# Altium schematic sheet 3-Power-Supply.SchDoc: Thermocouple Temperature Logger
size A4; Date: 14.03.2026; Author: MG & JK; Revision: 1-0; SheetNumber: 3; SheetTotal: 7; Model: Rev 1.0; PageSetup: Record=PageOptions|CenterHorizontal=True|CenterVertical=True|PrintScale=0.52|XCorrection=1.00|YCorrection=1.00|PrintKind=1|BorderSize=5000000|LeftOffset=0|BottomOffset=0|Orientation=2|PaperLength=4200|PaperWidth=2970|Scale=100|PaperSource=7|PrintQuality=600|MediaType=1|DitherType=10|PaperKind=A3|PrintScaleMode=1; SPICEModelCacheCZHDBFPD: <root> / <DocumentId>CZHDBFPD</DocumentId> / <CacheFrame Number="0"> / <Model Name="860020274017_1.5mf" Kind="CKT"> / <Text>******* / .subckt 860020274017_1.5mF 1 2 / Rser 1 3 0.093 / Lser 2 4 0.0000000299 / C1 3 4 0.0015 / Rpar 3 4 66666.6666666667 / .ends 860020274017_1.5mF</Text> / </Model> / <Model Name="4828_74408942033_3.3u" Kind="CKT"> / <Text>******* / .subckt 4828_74408942033_3.3u 1 2 / Rp 1 2 3423 / Cp 1 2 4.02904p / Rs 1 N3 0.0483 / L1 N3 2 3.3u / .ends 4828_74408942033_3.3u</Text> / </Model> / </CacheFrame> / </root>
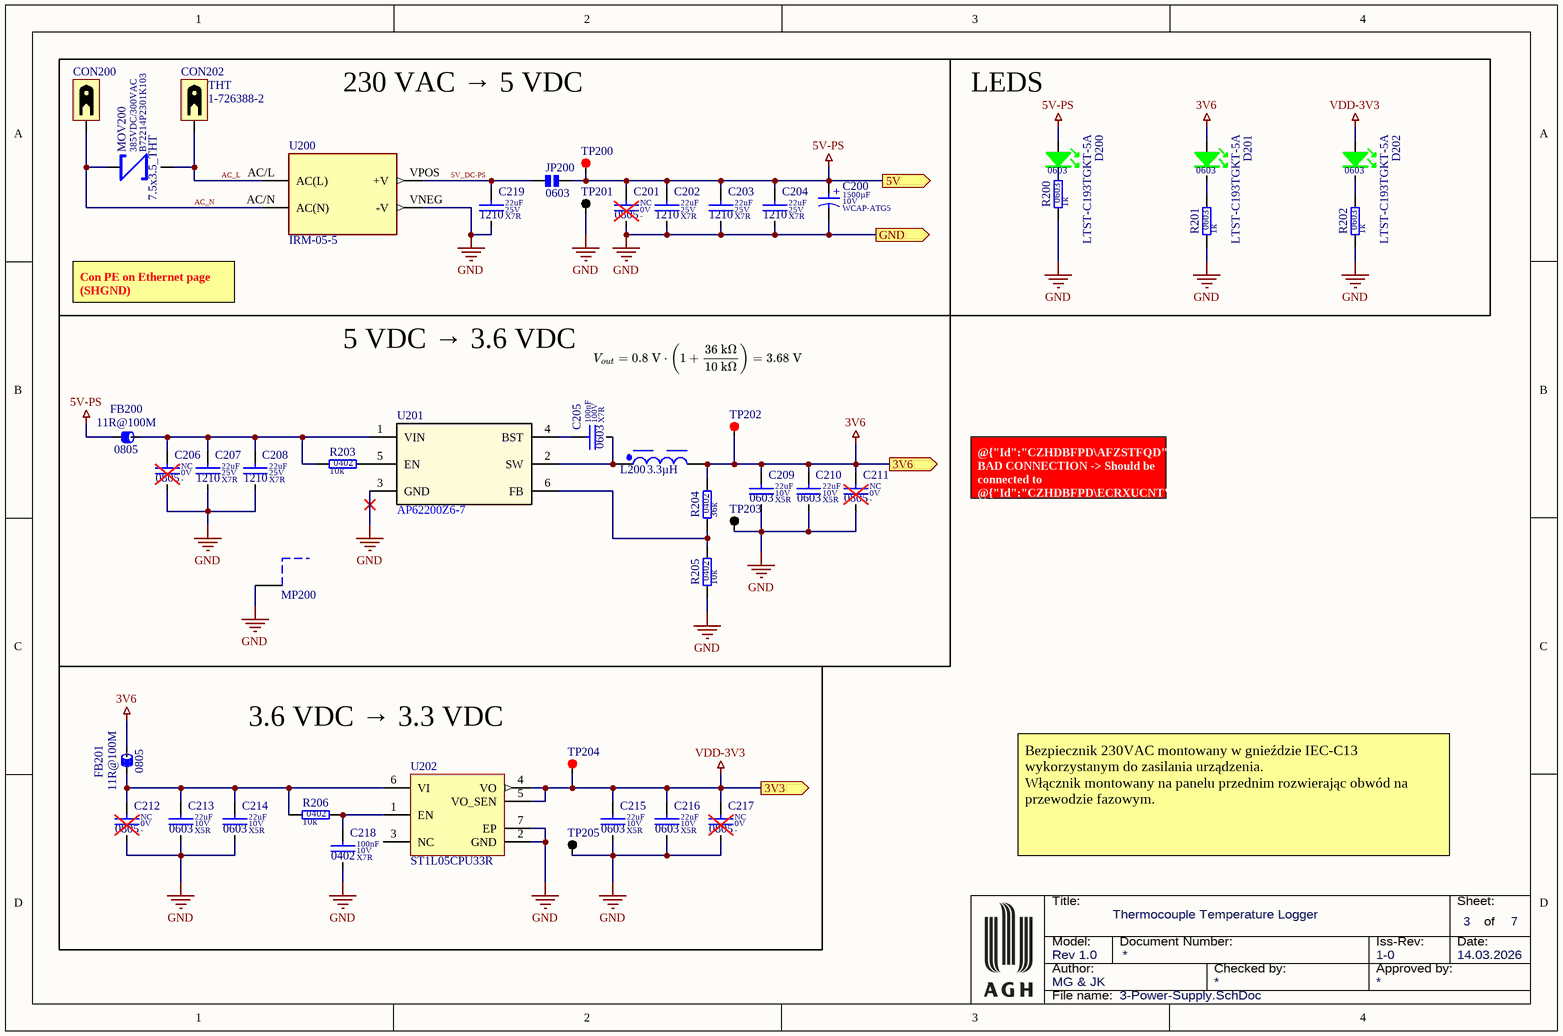
[diagram p0: 3-Power-Supply.SchDoc]

## Parts
C200  1500µF  Match Code: WCAP-ATG5  Rated Voltage (DC): 10V  [WCAP-ATG5_D8H20]
C201  value NC  Voltage: 0V  SCH_Footprint: 0805  [C_NC_0805_2012]  (hidden comment: -)  (no BOM)
C202  value 22uF  Dielectric: X7R  Voltage: 25V  SCH_Footprint: 1210  [C_1210_3225]  (hidden comment: Ceramic X7R Low ESR)
C203  value 22uF  Dielectric: X7R  Voltage: 25V  SCH_Footprint: 1210  [C_1210_3225]  (hidden comment: Ceramic X7R Low ESR)
C204  value 22uF  Dielectric: X7R  Voltage: 25V  SCH_Footprint: 1210  [C_1210_3225]  (hidden comment: Ceramic X7R Low ESR)
C205  value 100nF  Dielectric: X7R  Voltage: 100V  SCH_Footprint: 0603  [C_0603_1608]  (hidden comment: Ceramic X7R)
C206  value NC  Voltage: 0V  SCH_Footprint: 0805  [C_NC_0805_2012]  (hidden comment: -)  (no BOM)
C207  value 22uF  Dielectric: X7R  Voltage: 25V  SCH_Footprint: 1210  [C_1210_3225]  (hidden comment: Ceramic X7R Low ESR)
C208  value 22uF  Dielectric: X7R  Voltage: 25V  SCH_Footprint: 1210  [C_1210_3225]  (hidden comment: Ceramic X7R Low ESR)
C209  value 22uF  Dielectric: X5R  Voltage: 10V  SCH_Footprint: 0603  [C_0603_1608]  (hidden comment: Ceramic X5R)
C210  value 22uF  Dielectric: X5R  Voltage: 10V  SCH_Footprint: 0603  [C_0603_1608]  (hidden comment: Ceramic X5R)
C211  value NC  Voltage: 0V  SCH_Footprint: 0805  [C_NC_0805_2012]  (hidden comment: -)  (no BOM)
C212  value NC  Voltage: 0V  SCH_Footprint: 0805  [C_NC_0805_2012]  (hidden comment: -)  (no BOM)
C213  value 22uF  Dielectric: X5R  Voltage: 10V  SCH_Footprint: 0603  [C_0603_1608]  (hidden comment: Ceramic X5R)
C214  value 22uF  Dielectric: X5R  Voltage: 10V  SCH_Footprint: 0603  [C_0603_1608]  (hidden comment: Ceramic X5R)
C215  value 22uF  Dielectric: X5R  Voltage: 10V  SCH_Footprint: 0603  [C_0603_1608]  (hidden comment: Ceramic X5R)
C216  value 22uF  Dielectric: X5R  Voltage: 10V  SCH_Footprint: 0603  [C_0603_1608]  (hidden comment: Ceramic X5R)
C217  value NC  Voltage: 0V  SCH_Footprint: 0805  [C_NC_0805_2012]  (hidden comment: -)  (no BOM)
C218  value 100nF  Dielectric: X7R  Voltage: 10V  SCH_Footprint: 0402  [C_0402_1005]  (hidden comment: Ceramic X7R)
C219  value 22uF  Dielectric: X7R  Voltage: 25V  SCH_Footprint: 1210  [C_1210_3225]  (hidden comment: Ceramic X7R Low ESR)
CON200  Terminal for PE  [TP_1-726388-2]  (value not drawn)
CON202  value 1-726388-2  SCH_Footprint: THT  [TP_1-726388-2]  (hidden comment: Terminal for PE)
D200  value LTST-C193TGKT-5A  SCH_Footprint: 0603  [OL_0603_1608]  (hidden comment: Green Led 0603)
D201  value LTST-C193TGKT-5A  SCH_Footprint: 0603  [OL_0603_1608]  (hidden comment: Green Led 0603)
D202  value LTST-C193TGKT-5A  SCH_Footprint: 0603  [OL_0603_1608]  (hidden comment: Green Led 0603)
FB200  value 11R@100M  SCH_Footprint: 0805  [FB_0805_2012]  (hidden comment: Ferrite bead)
FB201  value 11R@100M  SCH_Footprint: 0805  [FB_0805_2012]  (hidden comment: Ferrite bead)
JP200  SCH_Footprint: 0603  [JP_0603_1608]  (hidden comment: Solder Jumper 0603/1608)
L200  Inductance: 3.3µH  [WE-SPC_4828]  (hidden comment: 3.3µH, 2.1A)
MOV200  value B72214P2301K103  SCH_Footprint: 7.5x3.5_THT  Voltage: 385VDC/300VAC  [MOV_AXIAL_7.5_3.5]  (hidden comment: MOV)
MP200  36702638  [36702638]  (value not drawn)
R200  value 1k  SCH_Footprint: 0603  [R_0603_1608]  (hidden comment: Resistor)
R201  value 1k  SCH_Footprint: 0603  [R_0603_1608]  (hidden comment: Resistor)
R202  value 1k  SCH_Footprint: 0603  [R_0603_1608]  (hidden comment: Resistor)
R203  value 10k  SCH_Footprint: 0402  [R_0402_1005]  (hidden comment: Resistor)
R204  value 36k  SCH_Footprint: 0402  [R_0402_1005]  (hidden comment: Resistor)
R205  value 10k  SCH_Footprint: 0402  [R_0402_1005]  (hidden comment: Resistor)
R206  value 10k  SCH_Footprint: 0402  [R_0402_1005]  (hidden comment: Resistor)
TP200  Test loop THT  [TP_KEYSTONE_5000_RED]  (value not drawn)
TP201  Test loop THT  [TP_KEYSTONE_5001_BLACK]  (value not drawn)
TP202  Test loop THT  [TP_KEYSTONE_5000_RED]  (value not drawn)
TP203  Test loop THT  [TP_KEYSTONE_5001_BLACK]  (value not drawn)
TP204  Test loop THT  [TP_KEYSTONE_5000_RED]  (value not drawn)
TP205  Test loop THT  [TP_KEYSTONE_5001_BLACK]  (value not drawn)
U200  IRM-05-5  [CONV_IRM-05-5]
U201  AP62200Z6-7  [SOT563-Z6_1_DIO]
U202  ST1L05CPU33R  [DFN6D_N]

## Blocks framed on the sheet
LEDS: D200-D202 R200-R202
5 VDC → 3.6 VDC: C205-C211 FB200 L200 MP200 R203-R205 TP202 TP203 U201
3.6 VDC → 3.3 VDC: C212-C218 FB201 R206 TP204 TP205 U202

## Ports
3V3 (out, see 1-Block-diagram[1A], 2-STM32H563[2A], 4-Ethernet[1A], 5-SD-Card[1A], 6-Connectors[1A]), 3V6 (out, see 1-Block-diagram[1A], 6-Connectors[1A], 7-LTC2983[1A]), 5V (out, see 1-Block-diagram[1A], 6-Connectors[1A]), GND (out, see 1-Block-diagram[1A], 2-STM32H563[2A], 4-Ethernet[1A], 5-SD-Card[1A], 6-Connectors[1A], 7-LTC2983[1A])

## Nets
3V6: C209.1 C210.1 C211.1 D201.2(A) FB201.2 L200.2 R204.2 TP202.1(TP) ; port 3V6
5V-PS: C200.1(P) C201.1 C202.1 C203.1 C204.1 D200.2(A) FB200.1 JP200.2 TP200.1(TP) ; port 5V
GND: C200.2(N) C201.2 C202.2 C203.2 C204.2 C206.2 C207.2 C208.2 C209.2 C210.2 C211.2 C212.2 C213.2 C214.2 C215.2 C216.2 C217.2 C218.2 C219.2 MP200.1 R200.1 R201.1 R202.1 R205.1 TP201.1(TP) TP203.1(TP) TP205.1(TP) U200.VNEG(-V) U201.3(GND) U202.2(GND) U202.7(EP) ; port GND
VDD-3V3: C215.1 C216.1 C217.1 D202.2(A) TP204.1(TP) U202.4(VO) U202.5(VO_SEN) ; port 3V3
5V_DC-PS: C219.1 JP200.1 U200.VPOS(+V)
AC_L: CON202.1(TP) MOV200.1 U200.AC/L(AC(L))
AC_N: CON200.1(TP) MOV200.2 U200.AC/N(AC(N))
NetC205_1: C205.1 U201.4(BST)
NetC205_2: C205.2 L200.1 U201.2(SW)
NetC206_1: C206.1 C207.1 C208.1 FB200.2 R203.1 U201.1(VIN)
NetC212_1: C212.1 C213.1 C214.1 FB201.1 R206.1 U202.6(VI)
NetC218_1: C218.1 R206.2 U202.1(EN)
NetD200_1: D200.1(K) R200.2
NetD201_1: D201.1(K) R201.2
NetD202_1: D202.1(K) R202.2
NetR203_2: R203.2 U201.5(EN)
NetR204_1: R204.1 R205.2 U201.6(FB)

Not connected (* = marked no-connect by the designer): U202 3(NC)

## Notes on the sheet
- 230 VAC → 5 VDC
- Con PE on Ethernet page (SHGND)
- @{"Id":"CZHDBFPD\AFZSTFQD","ObjectType":2} BAD CONNECTION -> Should be connected to @{"Id":"CZHDBFPD\ECRXUCNT","ObjectType":2} SW - BST not after inductor!
- Bezpiecznik 230VAC montowany w gnieździe IEC-C13 wykorzystanym do zasilania urządzenia.
  Włącznik montowany na panelu przednim rozwierając obwód na przewodzie fazowym.
- Title:
- Sheet:
- of
- Author:
- Model:
- Document Number:
- Checked by:
- Iss-Rev:
- Approved by:
- Date:
- File name:
- (in symbol 860020274017) +

## Library data of the parts
C200 = 860020274017: WCAP-ATG5 Aluminum Electrolytic Capacitor, Radial, THT, D8 x H20mm, 1500µF, 10V; Manufacturer: Wurth Elektronik; Capacitance Tolerance: +/-20%; Dissipation Factor: 17%; Endurance: 2000h; Leakage Current: 150µA; Ripple Current: 715mA; Technical Reference: ATDE200152M010DSPA7B000; Manufacturer Part Number: 860020274017; Category: Aluminum Electrolytic Capacitors; ComponentLink1Description: Website Link; ComponentLink1URL: https://www.we-online.com/redexpert/article/860020274017?ad; ComponentLink2Description: Datasheet Link; ComponentLink2URL: https://www.we-online.com/redexpert/spec/860020274017?ad; Mount: Through Hole; Operating Temperature Max: 105°C; Operating Temperature Min: -40°C; Packaging: Ammo Pack; Height: 20mm; Diameter: 8mm; Capacitance: 1500µF
C201 C206 C211 C212 C217 = C_GENERIC_0805: Capacitor; Tolerance (%): 0; Dielectric: -; Part Number: C_GENERIC_0805; HelpURL: -; Manufacturer: -; Manufacturer Part Number: -; Supplier 1: TME; Supplier 2: RS Components; Supplier 3: Farnell; Supplier 4: Mouser; Supplier 5: Digi-Key; Supplier 6: LCSC
C202-C204 C207 C208 C219 = C_22uF_25V_X7R_1210_20: Capacitor; Manufacturer: Murata; Manufacturer Part Number: GRM32ER71E226ME15L; Tolerance (%): 20; Part Number: C_22uF_25V_X7R_1210_20; HelpURL: https://www.murata.com/en-eu/api/pdfdownloadapi?cate=luCeramicCapacitorsSMD&partno=GRM32ER71E226ME15%23; Supplier 1: TME; Supplier 2: RS Components; Supplier Part Number 2: 8467372P; Supplier 3: Farnell; Supplier Part Number 3: 2218912; Supplier 4: Mouser; Supplier Part Number 4: 81-GRM32ER71E226ME5L; Supplier 5: Digi-Key; Supplier Part Number 5: 490-10758-1-ND; Supplier 6: LCSC; Supplier 7: Arrow Electronics; Supplier Part Number 7: GRM32ER71E226ME15L
C205 = C_100nF_100V_X7R_0603_10: Capacitor; Manufacturer: Kemet; Manufacturer Part Number: C0603X104K1RACTU; Tolerance (%): 10; Part Number: C_100nF_100V_X7R_0603_10; HelpURL: https://www.mouser.pl/datasheet/2/447/KEM_C1013_X7R_FT_CAP_SMD-3316633.pdf; Supplier 1: TME; Supplier 2: RS Components; Supplier 3: Farnell; Supplier Part Number 3: 4380077; Supplier 4: Mouser; Supplier Part Number 4: 80-C0603X104K1RACTU; Supplier 5: Digi-Key; Supplier Part Number 5: 399-C0603X104K1RACTUCT-ND; Supplier 6: LCSC
C209 C210 C213-C216 = C_22uF_10V_X5R_0603_20: Capacitor; Manufacturer: Murata; Manufacturer Part Number: GRM188R61A226ME15D; Tolerance (%): 20; Part Number: C_22uF_10V_X5R_0603_20; HelpURL: https://www.mouser.pl/datasheet/2/281/1/GRM188R61A226ME15_02A-1985787.pdf; Supplier 1: TME; Supplier Part Number 1: GRM188R61A226ME15D; Supplier 2: RS Components; Supplier 3: Farnell; Supplier Part Number 3: 2426957; Supplier 4: Mouser; Supplier Part Number 4: 81-GRM188R61A226ME5D; Supplier 5: Digi-Key; Supplier Part Number 5: 490-10476-1-ND; Supplier 6: LCSC
C218 = C_100nF_10V_X7R_0402_10: Capacitor; Manufacturer: Murata; Manufacturer Part Number: GRM155R71A104KA01D; Tolerance (%): 10; Part Number: C_100nF_10V_X7R_0402_10; HelpURL: https://octopart.com/datasheet/grm155r71a104ka01d-murata-6810561; Supplier 1: TME; Supplier Part Number 1: GRM155R71A104KA01D; Supplier 2: RS Components; Supplier 3: Farnell; Supplier Part Number 3: 1828860; Supplier 4: Mouser; Supplier Part Number 4: 81-GRM155R71A104KA1D; Supplier 5: Digi-Key; Supplier Part Number 5: 490-6321-1-ND; Supplier 6: LCSC
CON200 = TP_TERMINAL_1-726388-2: Terminal; Manufacturer: TE Connectivity; SCH_Footprint: THT; Value: 1-726388-2; Part Number: TP_TERMINAL_1-726388-2; HelpURL: https://datasheet.octopart.com/1-726388-2-TE-Connectivity-datasheet-13534909.pdf; Manufacturer Part Number: 1-726388-2; Supplier 1: TME; Supplier Part Number 1: 1-726388-2; Supplier 2: RS Components; Supplier Part Number 2: 6805772; Supplier 3: Farnell; Supplier Part Number 3: 2308760; Supplier 4: Mouser; Supplier Part Number 4: 571-1-726388-2; Supplier 5: Digi-Key; Supplier Part Number 5: 1-726388-2-ND; Supplier 6: LCSC
CON202 = TP_TERMINAL_1-726388-2: Terminal; Manufacturer: TE Connectivity; Part Number: TP_TERMINAL_1-726388-2; HelpURL: https://datasheet.octopart.com/1-726388-2-TE-Connectivity-datasheet-13534909.pdf; Manufacturer Part Number: 1-726388-2; Supplier 1: TME; Supplier Part Number 1: 1-726388-2; Supplier 2: RS Components; Supplier Part Number 2: 6805772; Supplier 3: Farnell; Supplier Part Number 3: 2308760; Supplier 4: Mouser; Supplier Part Number 4: 571-1-726388-2; Supplier 5: Digi-Key; Supplier Part Number 5: 1-726388-2-ND; Supplier 6: LCSC
D200-D202 = OL_G_0603_LTST-C193TGKT-5A: LED GREEN; Manufacturer: Lite-On; Part Number: OL_G_0603_LTST-C193TGKT-5A; HelpURL: https://pl.mouser.com/datasheet/2/239/Lite-On-LTST-C193TGKT-5A-1175398.pdf; Manufacturer Part Number: LTST-C193TGKT-5A; Supplier 1: TME; Supplier Part Number 1: LTST-C193TGKT-5A; Supplier 2: RS Components; Supplier Part Number 2: 6921063; Supplier 3: Farnell; Supplier 4: Mouser; Supplier Part Number 4: 859-LTSTC193TGKT5A; Supplier 5: Digi-Key; Supplier Part Number 5: 160-1832-1-ND; Supplier 6: LCSC
FB200 FB201 = FB_2508051107Y0: Manufacturer: Fair-Rite; Current: 300mA; Resistance: 100mR; Part Number: FB_2508051107Y0; HelpURL: https://datasheet.octopart.com/2508051107Y0-Fair-Rite-datasheet-834.pdf; Manufacturer Part Number: 2508051107Y0; Supplier 1: TME; Supplier 2: RS Components; Supplier 3: Farnell; Supplier Part Number 3: 1612004; Supplier 4: Mouser; Supplier Part Number 4: 623-2508051107Y0; Supplier 5: Digi-Key; Supplier Part Number 5: 1934-1397-1-ND; Supplier 6: LCSC
JP200 = JP_0603_1608: Value: -; Part Number: JP_0603_1608; HelpURL: -; Manufacturer: -; Manufacturer Part Number: -; Supplier 1: TME; Supplier 2: RS Components; Supplier 3: Farnell; Supplier 4: Mouser; Supplier 5: Digi-Key; Supplier 6: LCSC
L200 = 74408942033: WE-SPC SMT Power Inductor, size 4828, 3.3µH, 2.1A, 0.057Ω; Manufacturer: Wurth Elektronik; Case/Size Code: 4828; DC Resistance: 0.0483Ω; Saturation Current: 3.5A; Self Resonant Frequency: 44MHz; Manufacturer Part Number: 74408942033; Category: Shielded Power Inductors; Match Code: WE-SPC; ComponentLink1Description: Website Link; ComponentLink1URL: https://www.we-online.com/redexpert/article/74408942033?ad; ComponentLink2Description: Datasheet Link; ComponentLink2URL: https://www.we-online.com/redexpert/spec/74408942033?ad; Mount: Surface Mount; Operating Temperature Max: 125°C; Operating Temperature Min: -40°C; Packaging: Tape and Reel; Length: 4.8mm; Width: 4.8mm; Height: 2.8mm; DC Resistance Max: 0.057Ω; Rated Current: 2.1A
MOV200 = MOV_385VDC_300VAC_THT: Varistor; Manufacturer: Epcos; Part Number: MOV_385VDC_300VAC_THT; HelpURL: https://product.tdk.com/en/system/files?file=dam/doc/product/protection/voltage/lead-disk-varistor/data_sheet/70/db/var/siov_leaded_advanced_mp_s14_compact_series.pdf; Manufacturer Part Number: B72214P2301K103; Supplier 1: TME; Supplier 2: RS Components; Supplier 3: Farnell; Supplier Part Number 3: 3359824; Supplier 4: Mouser; Supplier Part Number 4: 871-B72214P2301K103; Supplier 5: Digi-Key; Supplier Part Number 5: 495-B72214P2301K103-ND; Supplier 6: LCSC
MP200 = 36702638: WE-SHC Shielding Cabinet, SMT Frame Seamless, Tin Plated, Tray, 26.3x19.8x8.1mm; Manufacturer: Wurth Elektronik; Base Material: Steel; ComponentLink1Description: Website Link; ComponentLink1URL: https://www.we-online.com/redexpert/article/36702638?ad; ComponentLink2Description: Datasheet Link; ComponentLink2URL: https://www.we-online.com/redexpert/spec/36702638?ad; Manufacturer Part Number: 36702638; Category: EMC Shielding; Match Code: WE-SHC; Mount: Surface Mount; Operating Temperature Max: 125°C; Operating Temperature Min: -40°C; Packaging: Tray; Length: 26.3mm; Width: 19.8mm; Height: 8.1mm; Plating: Tin Plated; Type: SMT Frame Seamless
R200-R202 = R_1k_0603_1_AECQ0: Manufacturer: Panasonic; Manufacturer Part Number: ERJ-3EKF1001V; Voltage: 75V; Power: 100mW; Tolerance: 1%; AEC-Q: 0; Part Number: R_1k_0603_1_AECQ0; HelpURL: https://industrial.panasonic.com/cdbs/www-data/pdf/RDA0000/AOA0000C304.pdf; Supplier 1: TME; Supplier Part Number 1: ERJ3EKF1001V; Supplier 2: RS Components; Supplier 3: Farnell; Supplier Part Number 3: 2303145; Supplier 4: Mouser; Supplier Part Number 4: 667-ERJ-3EKF1001V; Supplier 5: Digi-Key; Supplier Part Number 5: P1.00KHCT-ND; Supplier 6: LCSC
R203 R205 R206 = R_10k_0402_1: Manufacturer: Yageo; Manufacturer Part Number: RC0402FR-0710KL; Voltage: 50V; Power: 63mW; Tolerance: 1%; Part Number: R_10k_0402_1; HelpURL: http://www.tme.eu/pl/Document/1a2bc76e2be68b3b1670068306778ce6/rc0402yageo.pdf; Supplier 1: TME; Supplier Part Number 1: RC0402FR-0710K; Supplier 2: RS Components; Supplier 3: Farnell; Supplier 4: Mouser; Supplier 5: Digi-Key; Supplier 6: LCSC
R204 = R_36k_0402_1_AECQ0: Manufacturer: Panasonic; Manufacturer Part Number: ERJ-2RKF3602X; Voltage: 50V; Power: 100mW; Tolerance: 1%; AEC-Q: 0; Part Number: R_36k_0402_1_AECQ0; HelpURL: https://industrial.panasonic.com/cdbs/www-data/pdf/RDA0000/AOA0000C304.pdf; Supplier 1: TME; Supplier Part Number 1: ERJ2RKF3602X; Supplier 2: RS Components; Supplier 3: Farnell; Supplier Part Number 3: 2302794; Supplier 4: Mouser; Supplier Part Number 4: 667-ERJ-2RKF3602X; Supplier 5: Digi-Key; Supplier Part Number 5: P36.0KLCT-ND; Supplier 6: LCSC; Supplier Part Number 6: C409031
TP200 TP202 TP204 = TP_LOOP_MICRO_RED: Testpoint; Manufacturer: Keystone; Value: 5000; SCH_Footprint: THT; Part Number: TP_LOOP_MICRO_RED; HelpURL: https://www.keyelco.com/product.cfm/product_id/1309; Manufacturer Part Number: 5000; Supplier 1: TME; Supplier 2: RS Components; Supplier 3: Farnell; Supplier Part Number 3: 2250281; Supplier 4: Mouser; Supplier Part Number 4: 534-5000; Supplier 5: Digi-Key; Supplier Part Number 5: 36-5000-ND; Supplier 6: LCSC; Supplier Part Number 6: C5199900
TP201 TP203 TP205 = TP_LOOP_MICRO_BLACK: Testpoint; Manufacturer: Keystone; Value: 5001; SCH_Footprint: THT; Part Number: TP_LOOP_MICRO_BLACK; HelpURL: https://www.keyelco.com/product.cfm/product_id/1310; Manufacturer Part Number: 5001; Supplier 1: TME; Supplier 2: RS Components; Supplier 3: Farnell; Supplier Part Number 3: 2301278; Supplier 4: Mouser; Supplier Part Number 4: 534-5001; Supplier 5: Digi-Key; Supplier Part Number 5: 36-5001-ND; Supplier 6: LCSC; Supplier Part Number 6: C238122
U200 = IRM-05-5: Enclosed AC DC Converters 1 Uitgang 5V 1A 85 ~ 305 VAC, 120 ~ 430 VDC Input; MF: MEAN WELL; MP: IRM-05-5; Availability: Unavailable; Package: DIP-4 Mean Well; Value: *; Price: None; SnapEDA_Link: https://www.snapeda.com/parts/IRM-05-5/MEAN%20WELL%20USA%20Inc./view-part/364712/?ref=snap
U201 = AP62200Z6-7: Description; Manufacturer_Name: Diodes Inc; Copyright: Copyright (C) 2025 Ultra Librarian. All rights reserved.; Manufacturer_Part_Number: AP62200Z6-7; RefDes: RefDes; Type: Type
U202 = CMP-0244-00293-1: Very Low Quiescent BiCMOS Voltage Regulator, 3.3V, 6-Pin VFDFPN, Tape and Reel; ComponentLink2Description: Datasheet; ComponentLink1Description: Manufacturer URL; ComponentLink2URL: http://www.st.com/internet/com/TECHNICAL_RESOURCES/TECHNICAL_LITERATURE/DATASHEET/CD00186925.pdf; PackageVersion: 2008; PackageReference: DFN6D; PackageDescription: 6-Pin Plastic, Dual LLP, 3 x 3 mm Body, 0.95 mm Pitch, Exposed Pad; DatasheetVersion: 1/09/2009; ComponentLink1URL: http://www.st.com